# EAGLE schematic CAN Circuit (EAGLE 7.4.0)
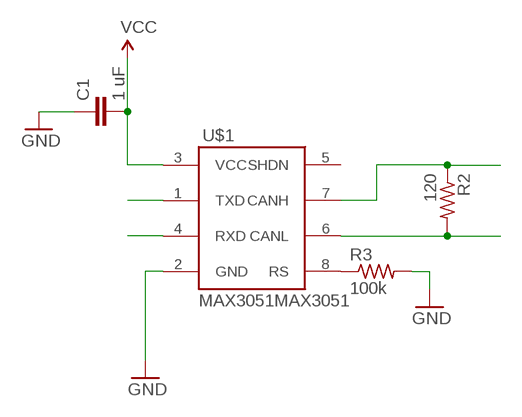
[diagram p0: schematic, sheet 1]

## Parts
C1  1 uF  C2,5-3  [C2.5-3]
R2  120  R-US_0204/2V  [0204V]
R3  100k  R-US_0204/2V  [0204V]
U$1  MAX3051MAX3051  [SOT23-8L]

## Nets
CANH: R2.1 U$1.7(CANH)
CANL: R2.2 U$1.6(CANL)
GND: C1.1 R3.2 U$1.2(GND)
N$1: R3.1 U$1.8(RS)
RXD: U$1.4(RXD)
TXD: U$1.1(TXD)
VCC: C1.2 U$1.3(VCC)
Unconnected: U$1.5(SHDN)

## Library data of the parts
C1 = capacitor-wima:C: CAPACITOR naming: grid - package width
R2 R3 = resistor:R-US_: RESISTOR, American symbol
U$1 = MAX3051 Library:MAX3051: Maxim Integrated MAX3051 CAN Tranciever